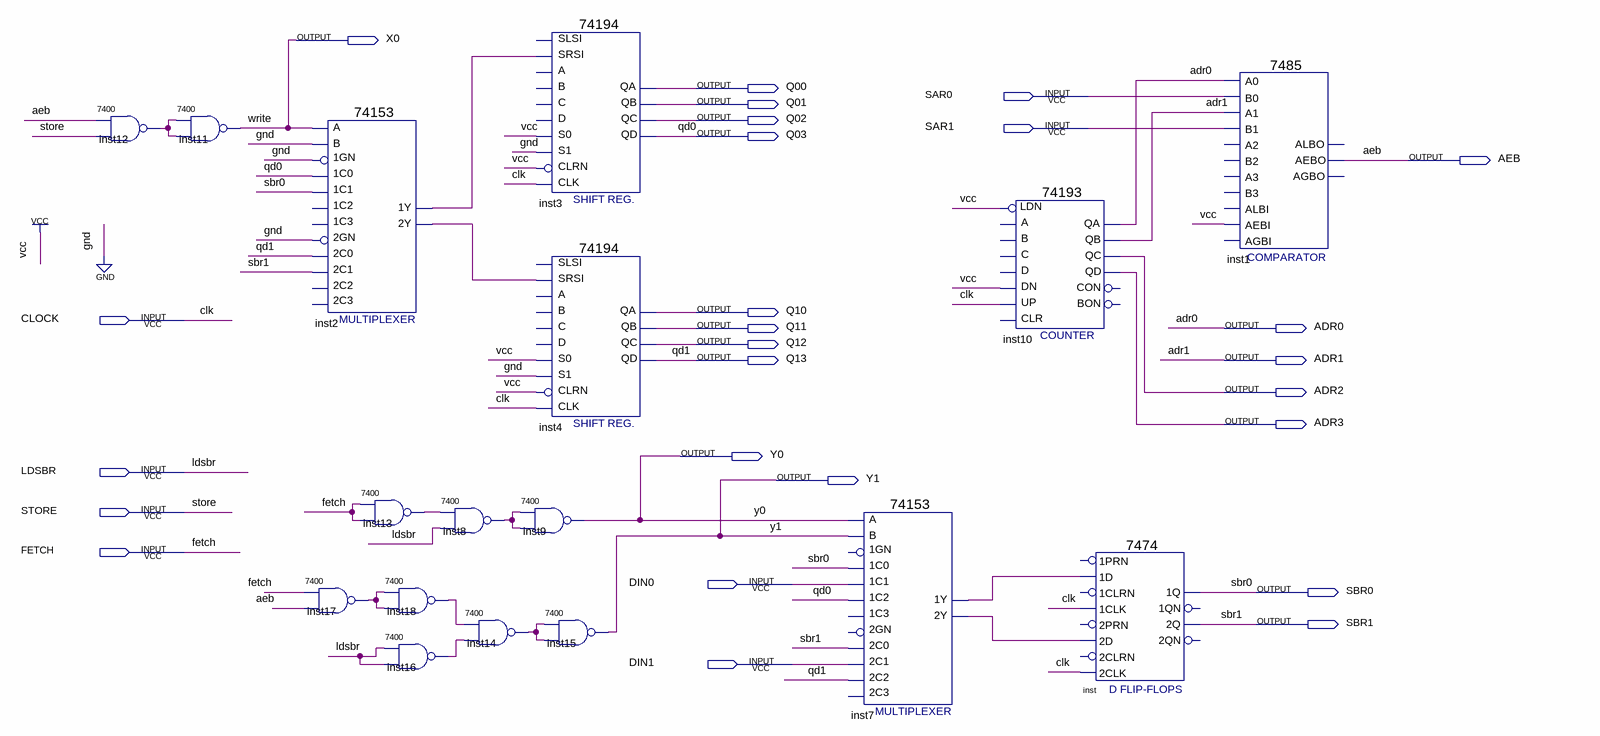
[diagram p0: schematic sheet]
// Quartus schematic Lab2.bdf as structural Verilog: 17 symbols, 26 pins
module Lab2 (
  input  SAR0,
  input  SAR1,
  input  CLOCK,
  input  LDSBR,
  input  STORE,
  input  FETCH,
  input  DIN0,
  input  DIN1,
  output X0,
  output Q00,
  output Q01,
  output Q02,
  output Q03,
  output AEB,
  output Q10,
  output Q11,
  output ADR0,
  output Q12,
  output Q13,
  output ADR1,
  output ADR2,
  output ADR3,
  output Y0,
  output Y1,
  output SBR0,
  output SBR1
);

  wire inst2_1y, inst2_2y, inst7_1y, inst7_2y, inst8_1, inst12_1, inst13_1, inst14_1, inst16_1, inst17_1,
       inst18_1;

  \7400  inst12 (.\3 (STORE), .\2 (AEB), .\1 (inst12_1));
  \7400  inst11 (.\3 (inst12_1), .\2 (inst12_1), .\1 (X0));
  \74153  inst2 (
    .\1C1 (SBR0), .\1GN (1'b0), .\1C0 (Q03), .\2C0 (Q13), .\2GN (1'b0), .B(1'b0), .A(X0), .\2C1 (SBR1),
    .\1Y (inst2_1y), .\2Y (inst2_2y));  // open: 2C2, 1C2, 1C3, 2C3
  \7400  inst17 (.\3 (AEB), .\2 (FETCH), .\1 (inst17_1));
  \7400  inst13 (.\3 (FETCH), .\2 (FETCH), .\1 (inst13_1));
  \7400  inst18 (.\3 (inst17_1), .\2 (inst17_1), .\1 (inst18_1));
  \7400  inst16 (.\3 (LDSBR), .\2 (LDSBR), .\1 (inst16_1));
  \7400  inst8 (.\3 (LDSBR), .\2 (inst13_1), .\1 (inst8_1));
  \7400  inst14 (.\3 (inst16_1), .\2 (inst18_1), .\1 (inst14_1));
  \7400  inst9 (.\3 (inst8_1), .\2 (inst8_1), .\1 (Y0));
  \74194  inst3 (
    .SRSI(inst2_1y), .CLK(CLOCK), .CLRN(1'b1), .S1(1'b0), .S0(1'b1), .QA(Q00), .QB(Q01), .QC(Q02), .QD(Q03));  // open: SLSI, B, C, D, A
  \74194  inst4 (
    .SRSI(inst2_2y), .CLK(CLOCK), .CLRN(1'b1), .S1(1'b0), .S0(1'b1), .QA(Q10), .QB(Q11), .QC(Q12), .QD(Q13));  // open: SLSI, B, C, D, A
  \7400  inst15 (.\3 (inst14_1), .\2 (inst14_1), .\1 (Y1));
  \74153  inst7 (
    .\1C1 (DIN0), .\1C0 (SBR0), .\2C0 (SBR1), .\2C2 (Q13), .\1C2 (Q03), .B(Y1), .A(Y0), .\2C1 (DIN1),
    .\1Y (inst7_1y), .\2Y (inst7_2y));  // open: 1GN, 2GN, 1C3, 2C3
  \74193  inst10 (
    .UP(CLOCK), .DN(1'b1), .LDN(1'b1), .QB(ADR1), .QA(ADR0), .QD(ADR3), .QC(ADR2));  // open: D, C, B, A, CLR, CON, BON
  \7474  inst (
    .\2D (inst7_2y), .\1CLK (CLOCK), .\1D (inst7_1y), .\2CLK (CLOCK), .\2Q (SBR1), .\1Q (SBR0));  // open: 2PRN, 1PRN, 2CLRN, 1CLRN, 1QN, 2QN
  \7485  inst1 (
    .AEBI(1'b1), .A0(ADR0), .B0(SAR0), .A1(ADR1), .B1(SAR1), .AEBO(AEB));  // open: A3, B2, A2, AGBI, ALBI, B3, ALBO, AGBO

  // Other names for the same wires on the sheet: clk = CLOCK; qd0 = Q03; qd1 = Q13; write = X0
endmodule
